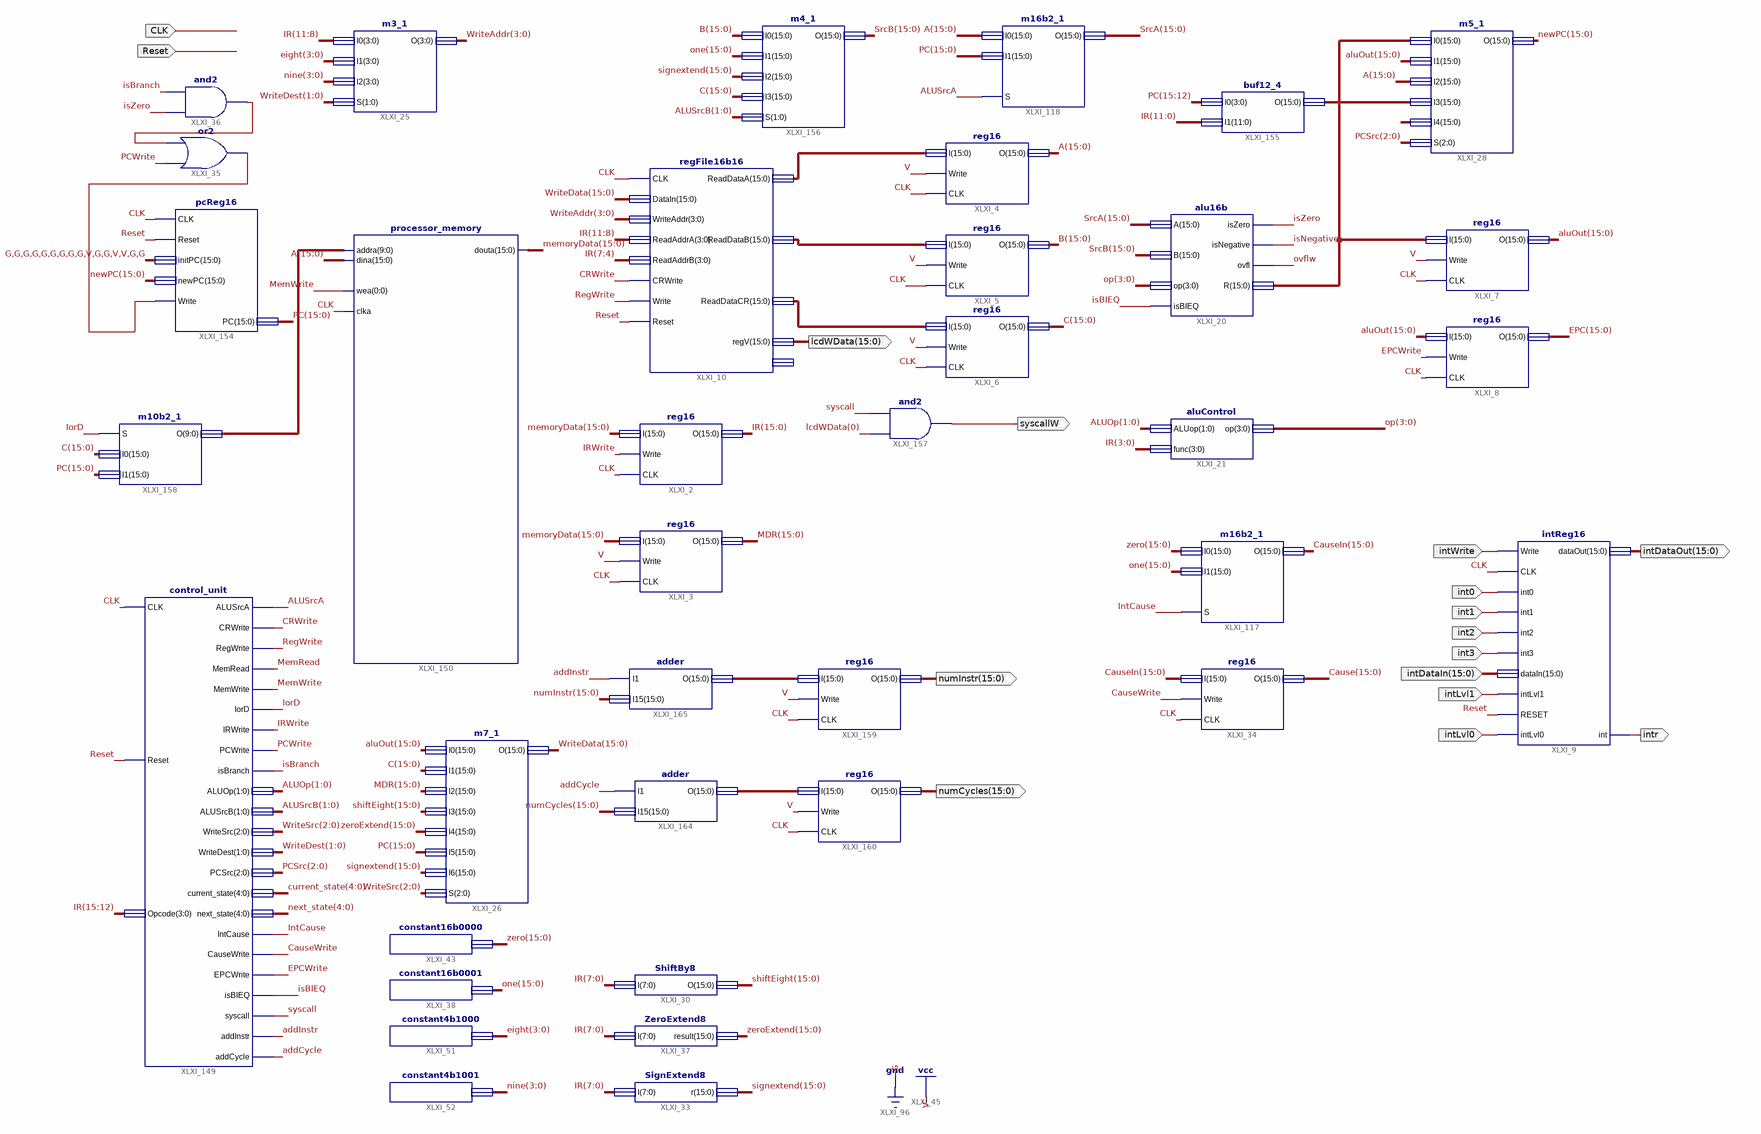
[diagram p0: schematic sheet 1]
// Xilinx ISE schematic datapath.sch (spartan3e) as structural Verilog: 37 symbols, 16 ports
module datapath (
  input  CLK,
  input  Reset,
  input  intWrite,
  input  int0,
  input  int1,
  input  int2,
  input  int3,
  input  [15:0] intDataIn,
  input  intLvl1,
  input  intLvl0,
  output [15:0] lcdWData,
  output intr,
  output [15:0] intDataOut,
  output syscallW,
  output [15:0] numInstr,
  output [15:0] numCycles
);

  wire addCycle, addInstr, ALUSrcA, CauseWrite, CRWrite, EPCWrite, IntCause, IorD, IRWrite, isBIEQ, isBranch,
       isNegative, isZero, MemRead, MemWrite, ovflw, PCWrite, RegWrite, syscall, XLXN_43, XLXN_675;
  wire [1:0] ALUOp, ALUSrcB, WriteDest;
  wire [2:0] PCSrc, WriteSrc;
  wire [3:0] eight, nine, op, WriteAddr;
  wire [4:0] current_state, next_state;
  wire [9:0] XLXN_693;
  wire [15:0] A, aluOut, B, C, Cause, CauseIn, EPC, IR, MDR, memoryData, newPC, one, PC, shiftEight,
       signextend, SrcA, SrcB, WriteData, XLXN_96, XLXN_132, XLXN_133, XLXN_136, XLXN_692, XLXN_696,
       XLXN_699, zero, zeroExtend;

  constant4b1001 XLXI_52 (.O(nine));
  constant4b1000 XLXI_51 (.O(eight));
  constant16b0001 XLXI_38 (.O(one));
  constant16b0000 XLXI_43 (.O(zero));
  m7_1 XLXI_26 (
    .I0(aluOut), .I1(C), .I2(MDR), .I3(shiftEight), .I4(zeroExtend), .I5(PC), .I6(signextend), .S(WriteSrc),
    .O(WriteData));
  regFile16b16 XLXI_10 (
    .CLK(CLK), .DataIn(WriteData), .WriteAddr(WriteAddr), .ReadAddrA(IR[11:8]), .ReadAddrB(IR[7:4]),
    .CRWrite(CRWrite), .Write(RegWrite), .Reset(Reset), .ReadDataA(XLXN_132), .ReadDataB(XLXN_133),
    .ReadDataCR(XLXN_136), .regV(lcdWData));  // open: regA0
  and XLXI_36 (XLXN_43, isZero, isBranch);
  or XLXI_35 (XLXN_675, PCWrite, XLXN_43);
  m3_1 XLXI_25 (.I0(IR[11:8]), .I1(eight), .I2(nine), .S(WriteDest), .O(WriteAddr));
  processor_memory XLXI_150 (.addra(XLXN_693), .dina(A), .wea(MemWrite), .clka(CLK), .douta(memoryData));
  pcReg16 XLXI_154 (.CLK(CLK), .Reset(Reset), .initPC(16'b0000000001001100), .newPC(newPC), .Write(XLXN_675), .PC(PC));
  SignExtend8 XLXI_33 (.I(IR[7:0]), .r(signextend));
  ZeroExtend8 XLXI_37 (.I(IR[7:0]), .result(zeroExtend));
  ShiftBy8 XLXI_30 (.I(IR[7:0]), .O(shiftEight));
  reg16 XLXI_7 (.I(XLXN_96), .Write(1'b1), .CLK(CLK), .O(aluOut));
  m5_1 XLXI_28 (.I0(XLXN_96), .I1(aluOut), .I2(A), .I3(XLXN_692), .I4(one), .S(PCSrc), .O(newPC));
  alu16b XLXI_20 (
    .A(SrcA), .B(SrcB), .op(op), .isZero(isZero), .isNegative(isNegative), .ovfl(ovflw), .R(XLXN_96),
    .isBIEQ(isBIEQ));
  aluControl XLXI_21 (.ALUop(ALUOp), .func(IR[3:0]), .op(op));
  reg16 XLXI_5 (.I(XLXN_133), .Write(1'b1), .CLK(CLK), .O(B));
  reg16 XLXI_6 (.I(XLXN_136), .Write(1'b1), .CLK(CLK), .O(C));
  reg16 XLXI_4 (.I(XLXN_132), .Write(1'b1), .CLK(CLK), .O(A));
  buf12_4 XLXI_155 (.I0(PC[15:12]), .I1(IR[11:0]), .O(XLXN_692));
  m16b2_1 XLXI_118 (.I0(A), .I1(PC), .O(SrcA), .S(ALUSrcA));
  m4_1 XLXI_156 (.I0(B), .I1(one), .I2(signextend), .I3(C), .S(ALUSrcB), .O(SrcB));
  reg16 XLXI_8 (.I(aluOut), .Write(EPCWrite), .CLK(CLK), .O(EPC));
  intReg16 XLXI_9 (
    .Write(intWrite), .CLK(CLK), .int0(int0), .int1(int1), .int2(int2), .int3(int3), .dataIn(intDataIn),
    .intLvl1(intLvl1), .RESET(Reset), .intLvl0(intLvl0), .dataOut(intDataOut), .\int (intr));
  m16b2_1 XLXI_117 (.I0(zero), .I1(one), .O(CauseIn), .S(IntCause));
  reg16 XLXI_34 (.I(CauseIn), .Write(CauseWrite), .CLK(CLK), .O(Cause));
  reg16 XLXI_3 (.I(memoryData), .Write(1'b1), .CLK(CLK), .O(MDR));
  reg16 XLXI_2 (.I(memoryData), .Write(IRWrite), .CLK(CLK), .O(IR));
  and XLXI_157 (syscallW, lcdWData[0], syscall);
  m10b2_1 XLXI_158 (.S(IorD), .I0(C), .I1(PC), .O(XLXN_693));
  reg16 XLXI_159 (.I(XLXN_696), .Write(1'b1), .CLK(CLK), .O(numInstr));
  reg16 XLXI_160 (.I(XLXN_699), .Write(1'b1), .CLK(CLK), .O(numCycles));
  control_unit XLXI_149 (
    .CLK(CLK), .Reset(Reset), .Opcode(IR[15:12]), .ALUSrcA(ALUSrcA), .CRWrite(CRWrite), .RegWrite(RegWrite),
    .MemRead(MemRead), .MemWrite(MemWrite), .IorD(IorD), .IRWrite(IRWrite), .PCWrite(PCWrite),
    .isBranch(isBranch), .isBIEQ(isBIEQ), .IntCause(IntCause), .CauseWrite(CauseWrite), .EPCWrite(EPCWrite),
    .syscall(syscall), .ALUOp(ALUOp), .ALUSrcB(ALUSrcB), .WriteSrc(WriteSrc), .WriteDest(WriteDest),
    .PCSrc(PCSrc), .current_state(current_state), .next_state(next_state), .addInstr(addInstr),
    .addCycle(addCycle));
  adder XLXI_164 (.I1(addCycle), .I15(numCycles), .O(XLXN_699));
  adder XLXI_165 (.I1(addInstr), .I15(numInstr), .O(XLXN_696));
endmodule
